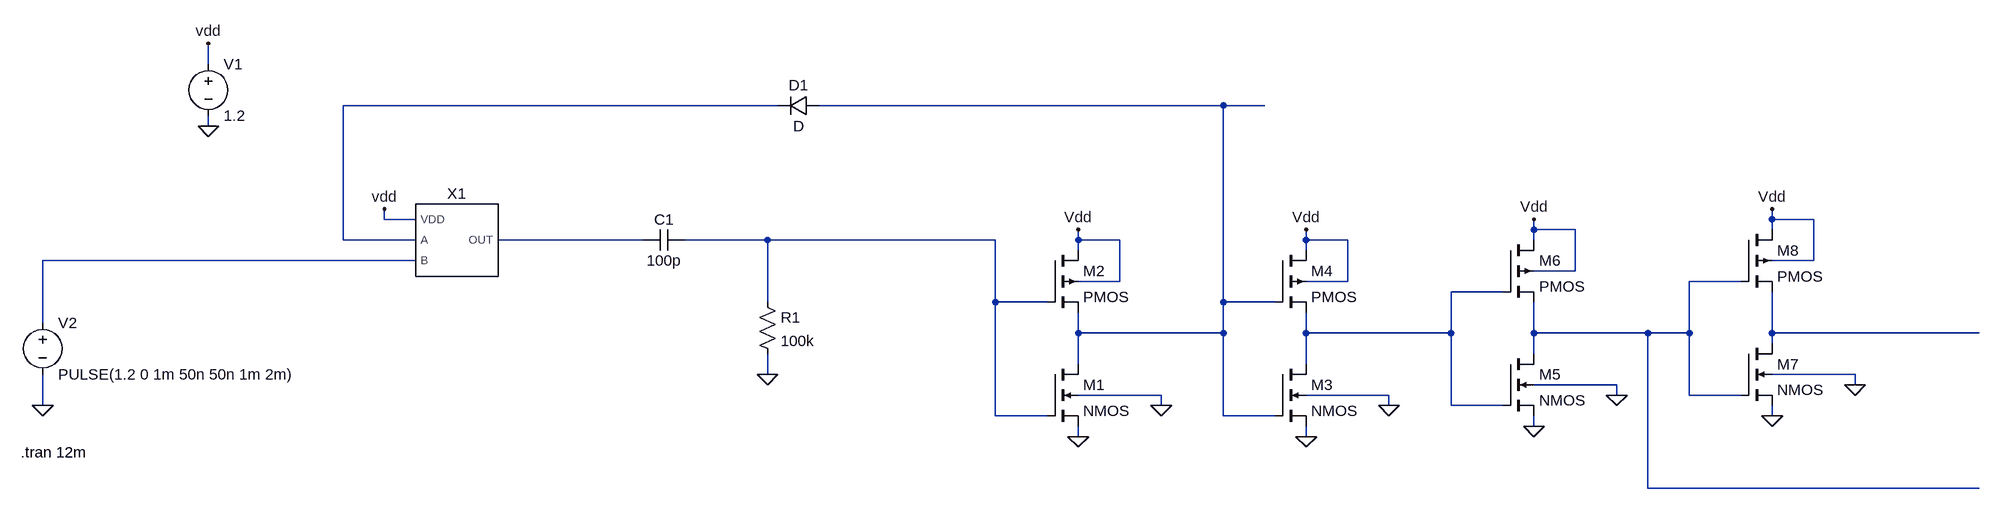
[diagram p0: schematic const_charger_c.asc]
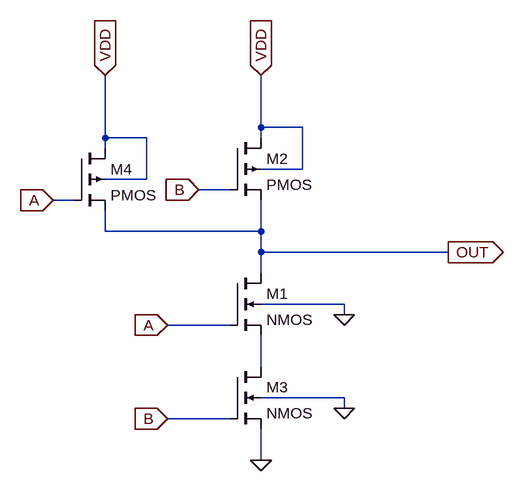
[diagram p1: sub-circuit nand.asc]
const_charger_c.asc, the LTspice schematic file:
Version 4
SHEET 1 2116 680
WIRE -624 -320 -624 -352
WIRE 256 -256 -416 -256
WIRE 944 -256 320 -256
WIRE 1008 -256 944 -256
WIRE -624 -224 -624 -240
WIRE -352 -80 -352 -96
WIRE -304 -80 -352 -80
WIRE 1792 -80 1792 -96
WIRE 1856 -80 1792 -80
WIRE 1424 -64 1424 -80
WIRE 1488 -64 1424 -64
WIRE 1792 -64 1792 -80
WIRE -416 -48 -416 -256
WIRE -304 -48 -416 -48
WIRE 48 -48 -176 -48
WIRE 240 -48 112 -48
WIRE 592 -48 240 -48
WIRE 720 -48 720 -64
WIRE 784 -48 720 -48
WIRE 1072 -48 1072 -64
WIRE 1136 -48 1072 -48
WIRE 1424 -48 1424 -64
WIRE 720 -32 720 -48
WIRE 1072 -32 1072 -48
WIRE -304 -16 -880 -16
WIRE 1856 -16 1856 -80
WIRE 1856 -16 1792 -16
WIRE 1488 0 1488 -64
WIRE 1488 0 1424 0
WIRE 784 16 784 -48
WIRE 784 16 720 16
WIRE 1136 16 1136 -48
WIRE 1136 16 1072 16
WIRE 1744 16 1664 16
WIRE 1376 32 1296 32
WIRE 240 48 240 -48
WIRE 592 48 592 -48
WIRE 672 48 592 48
WIRE 944 48 944 -256
WIRE 1024 48 944 48
WIRE -880 80 -880 -16
WIRE 720 96 720 64
WIRE 944 96 944 48
WIRE 944 96 720 96
WIRE 1072 96 1072 64
WIRE 1296 96 1296 32
WIRE 1296 96 1072 96
WIRE 1424 96 1424 48
WIRE 1600 96 1424 96
WIRE 1664 96 1664 16
WIRE 1664 96 1600 96
WIRE 1792 96 1792 32
WIRE 2112 96 1792 96
WIRE 1792 112 1792 96
WIRE 1424 128 1424 96
WIRE 720 144 720 96
WIRE 1072 144 1072 96
WIRE 240 160 240 128
WIRE 1920 160 1792 160
WIRE 1552 176 1424 176
WIRE 1920 176 1920 160
WIRE 848 192 720 192
WIRE 1200 192 1072 192
WIRE 1552 192 1552 176
WIRE 1664 192 1664 96
WIRE 1744 192 1664 192
WIRE -880 208 -880 160
WIRE 848 208 848 192
WIRE 1200 208 1200 192
WIRE 1296 208 1296 96
WIRE 1376 208 1296 208
WIRE 592 224 592 48
WIRE 672 224 592 224
WIRE 944 224 944 96
WIRE 1024 224 944 224
WIRE 1792 224 1792 208
WIRE 1424 240 1424 224
WIRE 720 256 720 240
WIRE 1072 256 1072 240
WIRE 1600 336 1600 96
WIRE 2112 336 1600 336
FLAG 720 256 0
FLAG 848 208 0
FLAG 720 -64 Vdd
FLAG -624 -224 0
FLAG -624 -352 vdd
FLAG -352 -96 vdd
FLAG 240 160 0
FLAG -880 208 0
FLAG 1072 256 0
FLAG 1200 208 0
FLAG 1072 -64 Vdd
FLAG 1424 240 0
FLAG 1552 192 0
FLAG 1424 -80 Vdd
FLAG 1792 224 0
FLAG 1920 176 0
FLAG 1792 -96 Vdd
SYMBOL nmos4 672 144 R0
SYMATTR InstName M1
SYMATTR Value2 l=200n w=2u
SYMBOL pmos4 672 -32 R0
SYMATTR InstName M2
SYMATTR Value2 l=200n w=4u
SYMBOL nand -240 -48 R0
SYMATTR InstName X1
SYMBOL voltage -624 -336 R0
WINDOW 123 0 0 Left 0
WINDOW 39 0 0 Left 0
SYMATTR InstName V1
SYMATTR Value 1.2
SYMBOL cap 112 -64 R90
WINDOW 0 0 32 VBottom 2
WINDOW 3 32 32 VTop 2
SYMATTR InstName C1
SYMATTR Value 100p
SYMBOL res 224 32 R0
SYMATTR InstName R1
SYMATTR Value 100k
SYMBOL voltage -880 64 R0
WINDOW 123 0 0 Left 0
WINDOW 39 0 0 Left 0
SYMATTR InstName V2
SYMATTR Value PULSE(1.2 0 1m 50n 50n 1m 2m)
SYMBOL diode 320 -272 R90
WINDOW 0 0 32 VBottom 2
WINDOW 3 32 32 VTop 2
SYMATTR InstName D1
SYMBOL nmos4 1024 144 R0
SYMATTR InstName M3
SYMATTR Value2 l=200n w=2u
SYMBOL pmos4 1024 -32 R0
SYMATTR InstName M4
SYMATTR Value2 l=200n w=4u
SYMBOL nmos4 1376 128 R0
SYMATTR InstName M5
SYMATTR Value2 l=200n w=2u
SYMBOL pmos4 1376 -48 R0
SYMATTR InstName M6
SYMATTR Value2 l=200n w=4u
SYMBOL nmos4 1744 112 R0
SYMATTR InstName M7
SYMATTR Value2 l=200n w=2u
SYMBOL pmos4 1744 -64 R0
SYMATTR InstName M8
SYMATTR Value2 l=200n w=4u
TEXT -914 280 Left 2 !.tran 12m

nand.asc, the sub-circuit schematic file:
Version 4
SHEET 1 880 680
WIRE 272 -32 272 -112
WIRE 336 -32 272 -32
WIRE 32 -16 32 -112
WIRE 96 -16 32 -16
WIRE 272 -16 272 -32
WIRE 32 0 32 -16
WIRE 336 32 336 -32
WIRE 336 32 272 32
WIRE 96 48 96 -16
WIRE 96 48 32 48
WIRE 224 64 176 64
WIRE -16 80 -48 80
WIRE 32 128 32 96
WIRE 272 128 272 80
WIRE 272 128 32 128
WIRE 272 160 272 128
WIRE 560 160 272 160
WIRE 272 192 272 160
WIRE 400 240 272 240
WIRE 400 256 400 240
WIRE 224 272 128 272
WIRE 272 336 272 288
WIRE 400 384 272 384
WIRE 400 400 400 384
WIRE 224 416 128 416
WIRE 272 480 272 432
FLAG 400 256 0
FLAG 400 400 0
FLAG 272 480 0
FLAG 32 -112 VDD
IOPIN 32 -112 In
FLAG 272 -112 VDD
IOPIN 272 -112 In
FLAG 128 272 A
IOPIN 128 272 In
FLAG -48 80 A
IOPIN -48 80 In
FLAG 176 64 B
IOPIN 176 64 In
FLAG 128 416 B
IOPIN 128 416 In
FLAG 560 160 OUT
IOPIN 560 160 Out
SYMBOL nmos4 224 192 R0
SYMATTR InstName M1
SYMATTR Value2 l=200n w=1u
SYMBOL pmos4 224 -16 R0
SYMATTR InstName M2
SYMATTR Value2 l=200n w=1.5u
SYMBOL nmos4 224 336 R0
SYMATTR InstName M3
SYMATTR Value2 l=200n w=1u
SYMBOL pmos4 -16 0 R0
SYMATTR InstName M4
SYMATTR Value2 l=200n w=1.5u

The netlist it stands for:
* const_charger_c.asc
M1 N002 N004 0 0 NMOS l=200n w=2u
M2 Vdd N004 N002 Vdd PMOS l=200n w=4u
XX1 N001 N005 Vdd N003 nand
V1 Vdd 0 1.2
C1 N004 N003 100p
R1 N004 0 100k
V2 N005 0 PULSE(1.2 0 1m 50n 50n 1m 2m)
D1 N002 N001 D
M3 N007 N002 0 0 NMOS l=200n w=2u
M4 Vdd N002 N007 Vdd PMOS l=200n w=4u
M5 N006 N007 0 0 NMOS l=200n w=2u
M6 Vdd N007 N006 Vdd PMOS l=200n w=4u
M7 N008 N006 0 0 NMOS l=200n w=2u
M8 Vdd N006 N008 Vdd PMOS l=200n w=4u

* block symbol definitions
.subckt nand A B VDD OUT
M1 OUT A N001 0 NMOS l=200n w=1u
M2 VDD B OUT VDD PMOS l=200n w=1.5u
M3 N001 B 0 0 NMOS l=200n w=1u
M4 VDD A OUT VDD PMOS l=200n w=1.5u
.ends nand

.model D D
.lib standard.dio
.model NMOS NMOS
.model PMOS PMOS
.lib standard.mos
.tran 12m
.backanno
.end